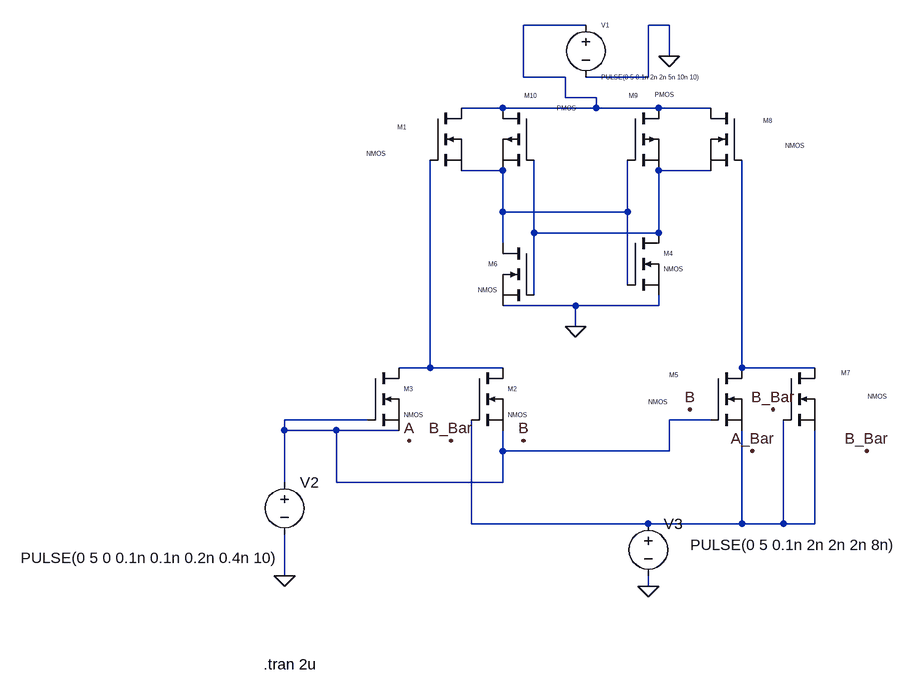
[diagram p0: schematic CPAL_currentModel.asc]
CPAL_currentModel.asc, the LTspice schematic file:
Version 4
SHEET 1 944 952
WIRE 144 -48 48 -48
WIRE 272 -48 240 -48
WIRE 272 0 272 -48
WIRE 48 32 48 -48
WIRE 112 32 48 32
WIRE 240 32 240 -48
WIRE 240 32 144 32
WIRE 112 64 112 32
WIRE 160 64 112 64
WIRE 16 80 -48 80
WIRE 160 80 160 64
WIRE 160 80 16 80
WIRE 256 80 160 80
WIRE 336 80 256 80
WIRE 16 176 -48 176
WIRE 336 176 256 176
WIRE 16 240 16 176
WIRE 208 240 208 160
WIRE 208 240 16 240
WIRE 64 272 64 160
WIRE 256 272 256 176
WIRE 256 272 64 272
WIRE 16 288 16 240
WIRE 208 352 208 240
WIRE 64 368 64 272
WIRE 128 384 16 384
WIRE 256 384 256 368
WIRE 256 384 128 384
WIRE 128 416 128 384
WIRE -96 480 -96 160
WIRE -96 480 -144 480
WIRE 16 480 -96 480
WIRE 384 480 384 160
WIRE 496 480 384 480
WIRE -192 560 -320 560
WIRE 336 560 272 560
WIRE -320 576 -320 560
WIRE -240 576 -320 576
WIRE -144 576 -240 576
WIRE 16 608 16 576
WIRE 272 608 272 560
WIRE 272 608 16 608
WIRE -320 656 -320 576
WIRE -240 656 -240 576
WIRE 16 656 16 608
WIRE 16 656 -240 656
WIRE -32 720 -32 560
WIRE 240 720 -32 720
WIRE 384 720 384 576
WIRE 384 720 240 720
WIRE 448 720 448 560
WIRE 448 720 384 720
WIRE 496 720 496 576
WIRE 496 720 448 720
WIRE -320 800 -320 736
WIRE 240 816 240 800
FLAG 128 416 0
FLAG 272 0 0
FLAG 400 608 A_Bar
FLAG 48 592 B
FLAG 576 608 B_Bar
FLAG 432 544 B_Bar
FLAG -64 592 B_Bar
FLAG -320 800 0
FLAG 240 816 0
FLAG -128 592 A
FLAG 304 544 B
SYMBOL nmos -96 80 R0
WINDOW 0 -50 29 Left 0
WINDOW 3 -98 70 Left 0
SYMATTR InstName M1
SYMBOL nmos -32 480 R0
WINDOW 0 56 32 Left 0
WINDOW 3 56 72 Left 0
SYMATTR InstName M2
SYMBOL nmos -192 480 R0
WINDOW 0 56 32 Left 0
WINDOW 3 56 72 Left 0
SYMATTR InstName M3
SYMBOL nmos 208 272 R0
WINDOW 0 56 32 Left 0
WINDOW 3 56 56 Left 0
SYMATTR InstName M4
SYMBOL nmos 336 480 R0
WINDOW 0 -64 11 Left 0
WINDOW 3 -96 52 Left 0
SYMATTR InstName M5
SYMBOL nmos 64 288 M0
WINDOW 0 56 32 Left 0
WINDOW 3 56 72 Left 0
SYMATTR InstName M6
SYMBOL nmos 448 480 R0
WINDOW 0 89 8 Left 0
WINDOW 3 130 44 Left 0
SYMATTR InstName M7
SYMBOL nmos 384 80 M0
WINDOW 0 -47 19 Left 0
WINDOW 3 -97 58 Left 0
SYMATTR InstName M8
SYMBOL pmos 208 80 R0
WINDOW 0 2 -19 Left 0
WINDOW 3 42 -21 Left 0
SYMATTR InstName M9
SYMBOL pmos 64 80 M0
WINDOW 0 -5 -19 Left 0
WINDOW 3 -65 0 Left 0
SYMATTR InstName M10
SYMBOL voltage 144 -64 R0
WINDOW 0 24 16 Left 0
WINDOW 3 24 96 Left 0
WINDOW 123 0 0 Left 0
WINDOW 39 0 0 Left 0
SYMATTR InstName V1
SYMATTR Value PULSE(0 5 0.1n 2n 2n 5n 10n 10)
SYMBOL voltage -320 640 R0
WINDOW 123 0 0 Left 0
WINDOW 39 0 0 Left 0
WINDOW 3 -406 132 Left 2
SYMATTR Value PULSE(0 5 0 0.1n 0.1n 0.2n 0.4n 10)
SYMATTR InstName V2
SYMBOL voltage 240 704 R0
WINDOW 123 0 0 Left 0
WINDOW 39 0 0 Left 0
WINDOW 3 65 48 Left 2
SYMATTR Value PULSE(0 5 0.1n 2n 2n 2n 8n)
SYMATTR InstName V3
TEXT -352 936 Left 2 !.tran 2u

The netlist it stands for:
* CPAL_currentModel.asc
M1 N001 N004 N002 N002 NMOS
M2 N004 N007 N006 N006 NMOS
M3 N004 N006 N006 N006 NMOS
M4 N003 N002 0 0 NMOS
M5 N005 N006 N007 N007 NMOS
M6 N002 N003 0 0 NMOS
M7 N005 N007 N007 N007 NMOS
M8 N001 N005 N003 N003 NMOS
M9 N001 N002 N003 N003 PMOS
M10 N001 N003 N002 N002 PMOS
V1 N001 0 PULSE(0 5 0.1n 2n 2n 5n 10n 10)
V2 N006 0 PULSE(0 5 0 0.1n 0.1n 0.2n 0.4n 10)
V3 N007 0 PULSE(0 5 0.1n 2n 2n 2n 8n)
.model NMOS NMOS
.model PMOS PMOS
.lib standard.mos
.tran 2u
.backanno
.end